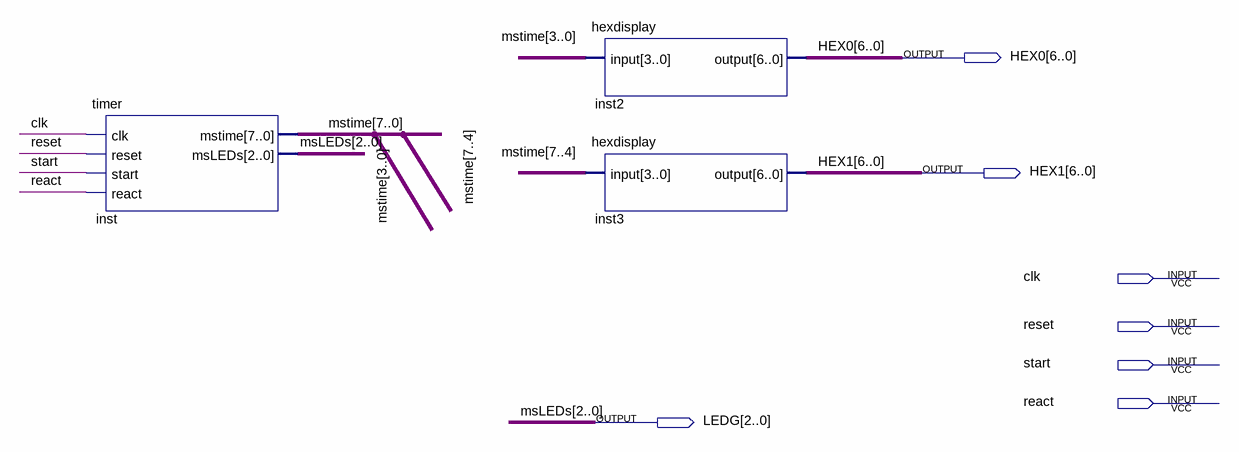
[diagram p0: schematic sheet]
// Quartus schematic reaction.bdf as structural Verilog: 3 symbols, 7 pins
module reaction (
  input  clk,
  input  reset,
  input  start,
  input  react,
  output [6:0] HEX0,
  output [6:0] HEX1,
  output [2:0] LEDG
);

  wire [7:0] mstime;

  timer inst (.clk(clk), .reset(reset), .start(start), .react(react), .mstime(mstime), .msLEDs(LEDG));
  hexdisplay inst2 (.\input (mstime[3:0]), .\output (HEX0));
  hexdisplay inst3 (.\input (mstime[7:4]), .\output (HEX1));

  // Other names for the same wires on the sheet: msLEDs[2:0] = LEDG
endmodule
